# Altium schematic sheet MCU.SchDoc
size A4; SheetNumber: 4; SheetTotal: 8
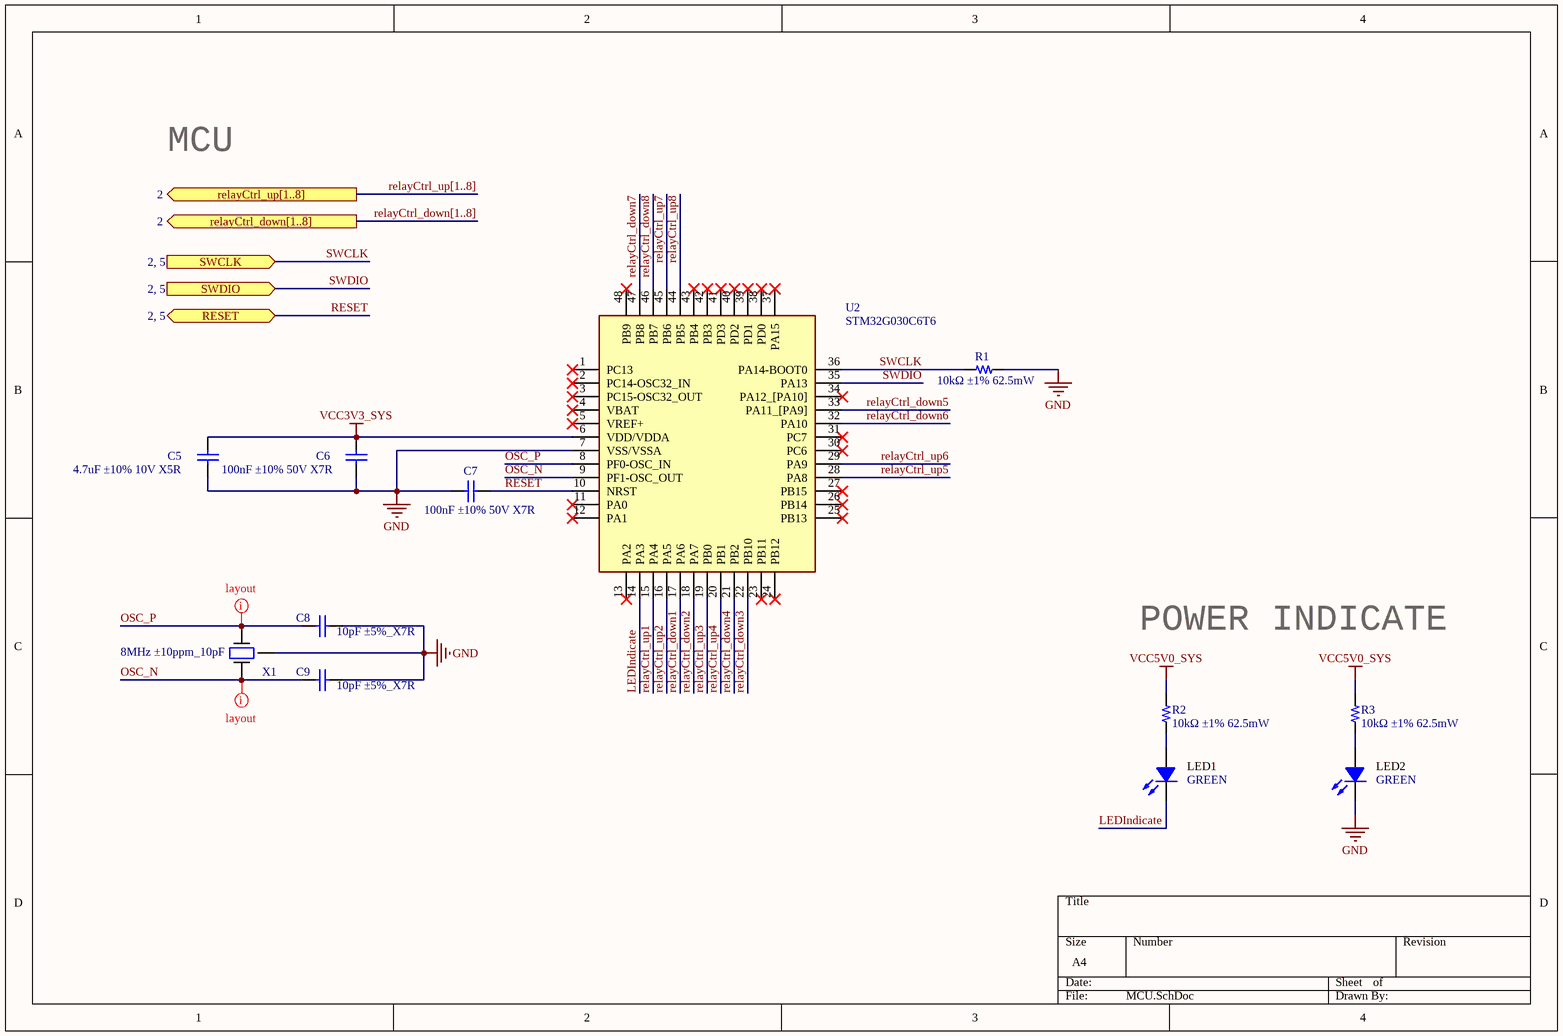
[diagram p0: MCU.SchDoc]

## Parts
C5  4.7uF ±10% 10V X5R  [C0402]
C6  100nF ±10% 50V X7R  [C0402]
C7  100nF ±10% 50V X7R  [C0402]
C8  10pF ±5%_X7R  [C0402]
C9  10pF ±5%_X7R  [C0402]
LED1  GREEN  [LED0603-RD]
LED2  GREEN  [LED0603-RD]
R1  10kΩ ±1% 62.5mW  [R0402]
R2  10kΩ ±1% 62.5mW  [R0402]
R3  10kΩ ±1% 62.5mW  [R0402]
U2  STM32G030C6T6  [QFP50P900X900X160-48N]
X1  8MHz ±10ppm_10pF  [CRYSTAL_3225]

## Ports
relayCtrl_down[1..8] (out, see 2), relayCtrl_up[1..8] (out, see 2), RESET (bidir, see 2, 5), SWCLK (in, see 2, 5), SWDIO (in, see 2, 5)

## Nets
GND: C5.1 C6.1 C7.1 C8.2 C9.2 LED2.2(K) R1.1 U2.7(VSS/VSSA) X1.G
VCC3V3_SYS: C5.2 C6.2 U2.6(VDD/VDDA)
VCC5V0_SYS: R2.1 R3.1
LEDIndicate: LED1.2(K) U2.14(PA3)
OSC_N: C9.1 U2.9(PF1-OSC_OUT) X1.1
OSC_P: C8.1 U2.8(PF0-OSC_IN) X1.3
relayCtrl_down1: U2.17(PA6)
relayCtrl_down2: U2.18(PA7)
relayCtrl_down3: U2.22(PB10)
relayCtrl_down4: U2.21(PB2)
relayCtrl_down5: U2.33(PA11_[PA9])
relayCtrl_down6: U2.32(PA10)
relayCtrl_down7: U2.47(PB8)
relayCtrl_down8: U2.46(PB7)
relayCtrl_up1: U2.15(PA4)
relayCtrl_up2: U2.16(PA5)
relayCtrl_up3: U2.19(PB0)
relayCtrl_up4: U2.20(PB1)
relayCtrl_up5: U2.28(PA8)
relayCtrl_up6: U2.29(PA9)
relayCtrl_up7: U2.45(PB6)
relayCtrl_up8: U2.44(PB5)
RESET: C7.2 U2.10(NRST) ; port RESET
SWCLK: R1.2 U2.36(PA14-BOOT0) ; port SWCLK
SWDIO: U2.35(PA13) ; port SWDIO
NetLED1_1: LED1.1(A) R2.2
NetLED2_1: LED2.1(A) R3.2

Not connected (* = marked no-connect by the designer): U2 1(PC13)* 2(PC14-OSC32_IN)* 3(PC15-OSC32_OUT)* 4(VBAT)* 5(VREF+)* 11(PA0)* 12(PA1)* 13(PA2)* 23(PB11)* 24(PB12)* 25(PB13)* 26(PB14)* 27(PB15)* 30(PC6)* 31(PC7)* 34(PA12_[PA10])* 37(PA15)* 38(PD0)* 39(PD1)* 40(PD2)* 41(PD3)* 42(PB3)* 43(PB4)* 48(PB9)*

## Buses and harness runs
bus relayCtrl_down[1..8] = port relayCtrl_down[1..8]
bus relayCtrl_up[1..8] = port relayCtrl_up[1..8]

## Layout directives
mark named layout: OSC_N, OSC_P

## Notes on the sheet
- MCU
- POWER INDICATE

## Library data of the parts
C5 = Cap: CL05A475KP5NRNC; Published: 8-Jun-2000; LatestRevisionDate: 17-Jul-2002; LatestRevisionNote: Re-released for DXP Platform.; PackageReference: RAD-0.3; Publisher: Altium Limited; PackageDescription: Radial Cap, Thru-Hole; 2 Leads; 0.3 in Pin Spacing
C6 C7 = Cap: CL05B104KO5NNNC; Published: 8-Jun-2000; LatestRevisionDate: 17-Jul-2002; LatestRevisionNote: Re-released for DXP Platform.; PackageReference: RAD-0.3; Publisher: Altium Limited; PackageDescription: Radial Cap, Thru-Hole; 2 Leads; 0.3 in Pin Spacing
C8 C9 = Cap: Capacitor; Published: 8-Jun-2000; LatestRevisionDate: 17-Jul-2002; LatestRevisionNote: Re-released for DXP Platform.; PackageReference: RAD-0.3; Publisher: Altium Limited; PackageDescription: Radial Cap, Thru-Hole; 2 Leads; 0.3 in Pin Spacing
LED1 LED2 = LED: 发光颜色:; Manufacturer: EVERLIGHT(亿光); Name: 17-21SURC/S530-A2/TR8; Add into BOM: yes; Emitted Color: 红灯; Symbol: 17-21SURC/S530-A2/TR8; Device: 17-21SURC/S530-A2/TR8; LCSC Part Name: 红灯; Supplier Part: C131244; Manufacturer Part: 17-21SURC/S530-A2/TR8; Supplier Footprint: 0805; JLCPCB Part Class: Extended Part; Datasheet: https://atta.szlcsc.com/upload/public/pdf/source/20170918/C131244_1505726880590976254.pdf; Supplier: LCSC; Convert to PCB: yes
R1-R3 = R-0603: 0402WGF1002TCE
U2 = STM32G030C6T6: Integrated Circuit; Manufacturer_Name: STMicroelectronics; Datasheet Link: https://datasheet.datasheetarchive.com/originals/distributors/Datasheets_SAMA/41d698f2d3eefcd1331311559e90da5e.pdf; Height: 1.6mm; Manufacturer_Part_Number: STM32G030C6T6; Mouser Part Number: 511-STM32G030C6T6; Mouser Price/Stock: https://www.mouser.co.uk/ProductDetail/STMicroelectronics/STM32G030C6T6?qs=uwxL4vQweFNhONHhoas%2FMg%3D%3D; Arrow Part Number: STM32G030C6T6; Arrow Price/Stock: https://www.arrow.com/en/products/stm32g030c6t6/stmicroelectronics?utm_currency=USD&region=nac
X1 = CRYSTAL: Crystal 8MHz ±10ppm 10pF 200 Ohm -10°C ~ 60°C Surface Mount 4-SMD, No Lead (DFN, LCC); Manufacturer: Abracon LLC; Manufacturer Part Number: ABM3B-8.000MHZ-10-1-U-T; Operating Mode: Fundamental; Supplier 1: Digi-Key; Supplier Part Number 1: 535-9721-1-ND; RoHS: RoHS Compliant; Category: Crystals, Oscillators, Resonators; Stock: 35437; Pricing 1: 1=0.69, 10=0.578, 50=0.5198, 100=0.462, 500=0.4389 (USD); Packaging: Cut Tape (CT); Part Status: Active; Type: MHz Crystal; Frequency Stability: ±10ppm; Frequency Tolerance: ±10ppm; Load Capacitance: 10pF; Operating Temperature: -10°C ~ 60°C; Ratings: -; Mounting Type: Surface Mount; Package / Case: 4-SMD, No Lead; Size / Dimension: 0.197" L x 0.126" W (5.00mm x 3.20mm); Height - Seated (Max): 0.043" (1.10mm); ComponentLink1URL: http://www.abracon.com/Resonators/abm3b.pdf; ComponentLink1Description: http://www.abracon.com/Resonators/abm3b.pdf; Supplier 2: Digi-Key; Supplier Part Number 2: 535-9721-2-ND; Pricing 2: 1000=0.336, 3000=0.315, 5000=0.3045, 10000=0.294 (USD)